# EAGLE design UIAPduino_Pro_Micro_CH32V006_V1dot0 (EAGLE 9.6.2)
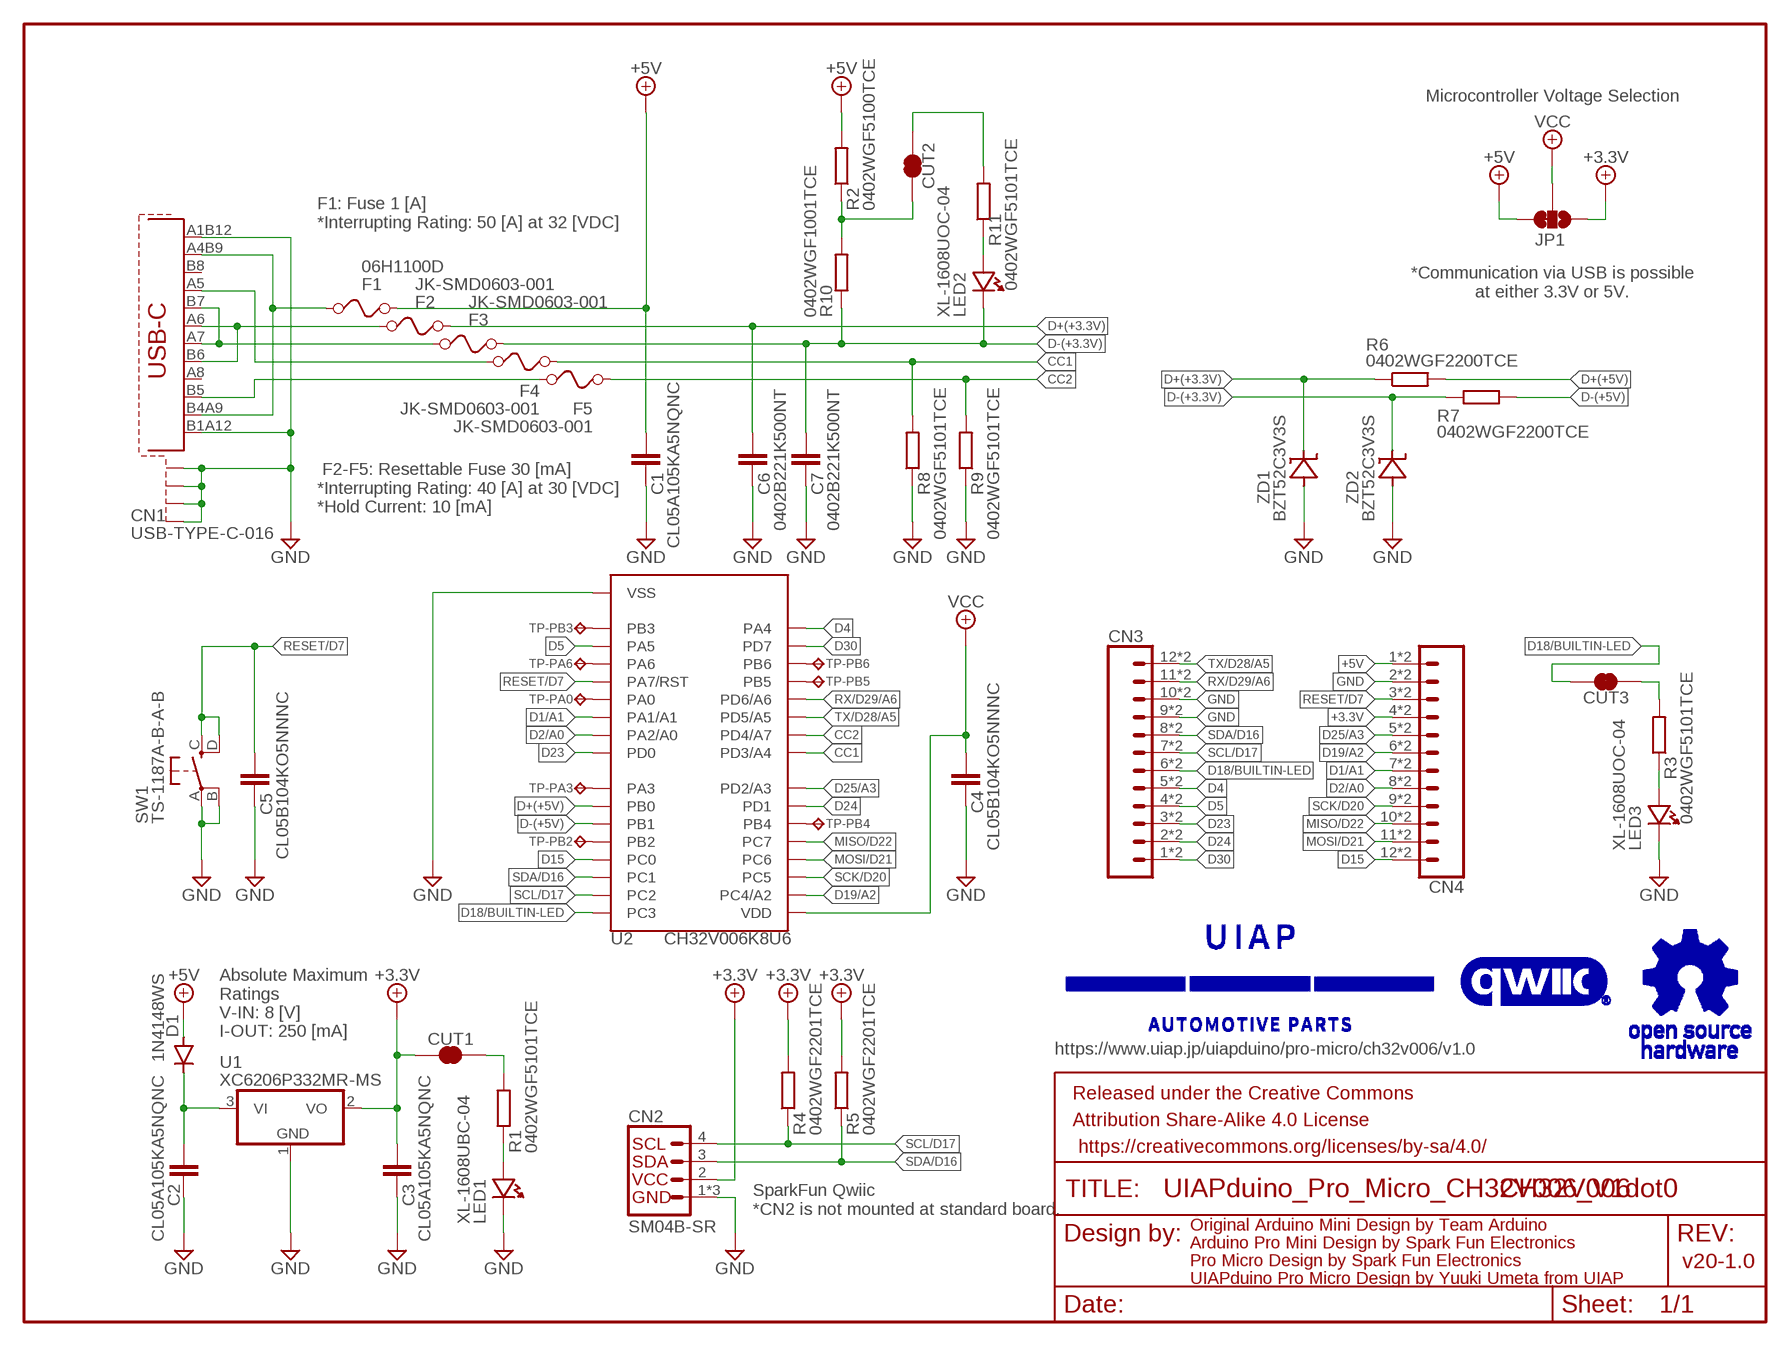
[diagram p0: schematic, sheet 1, part 1 of 2]
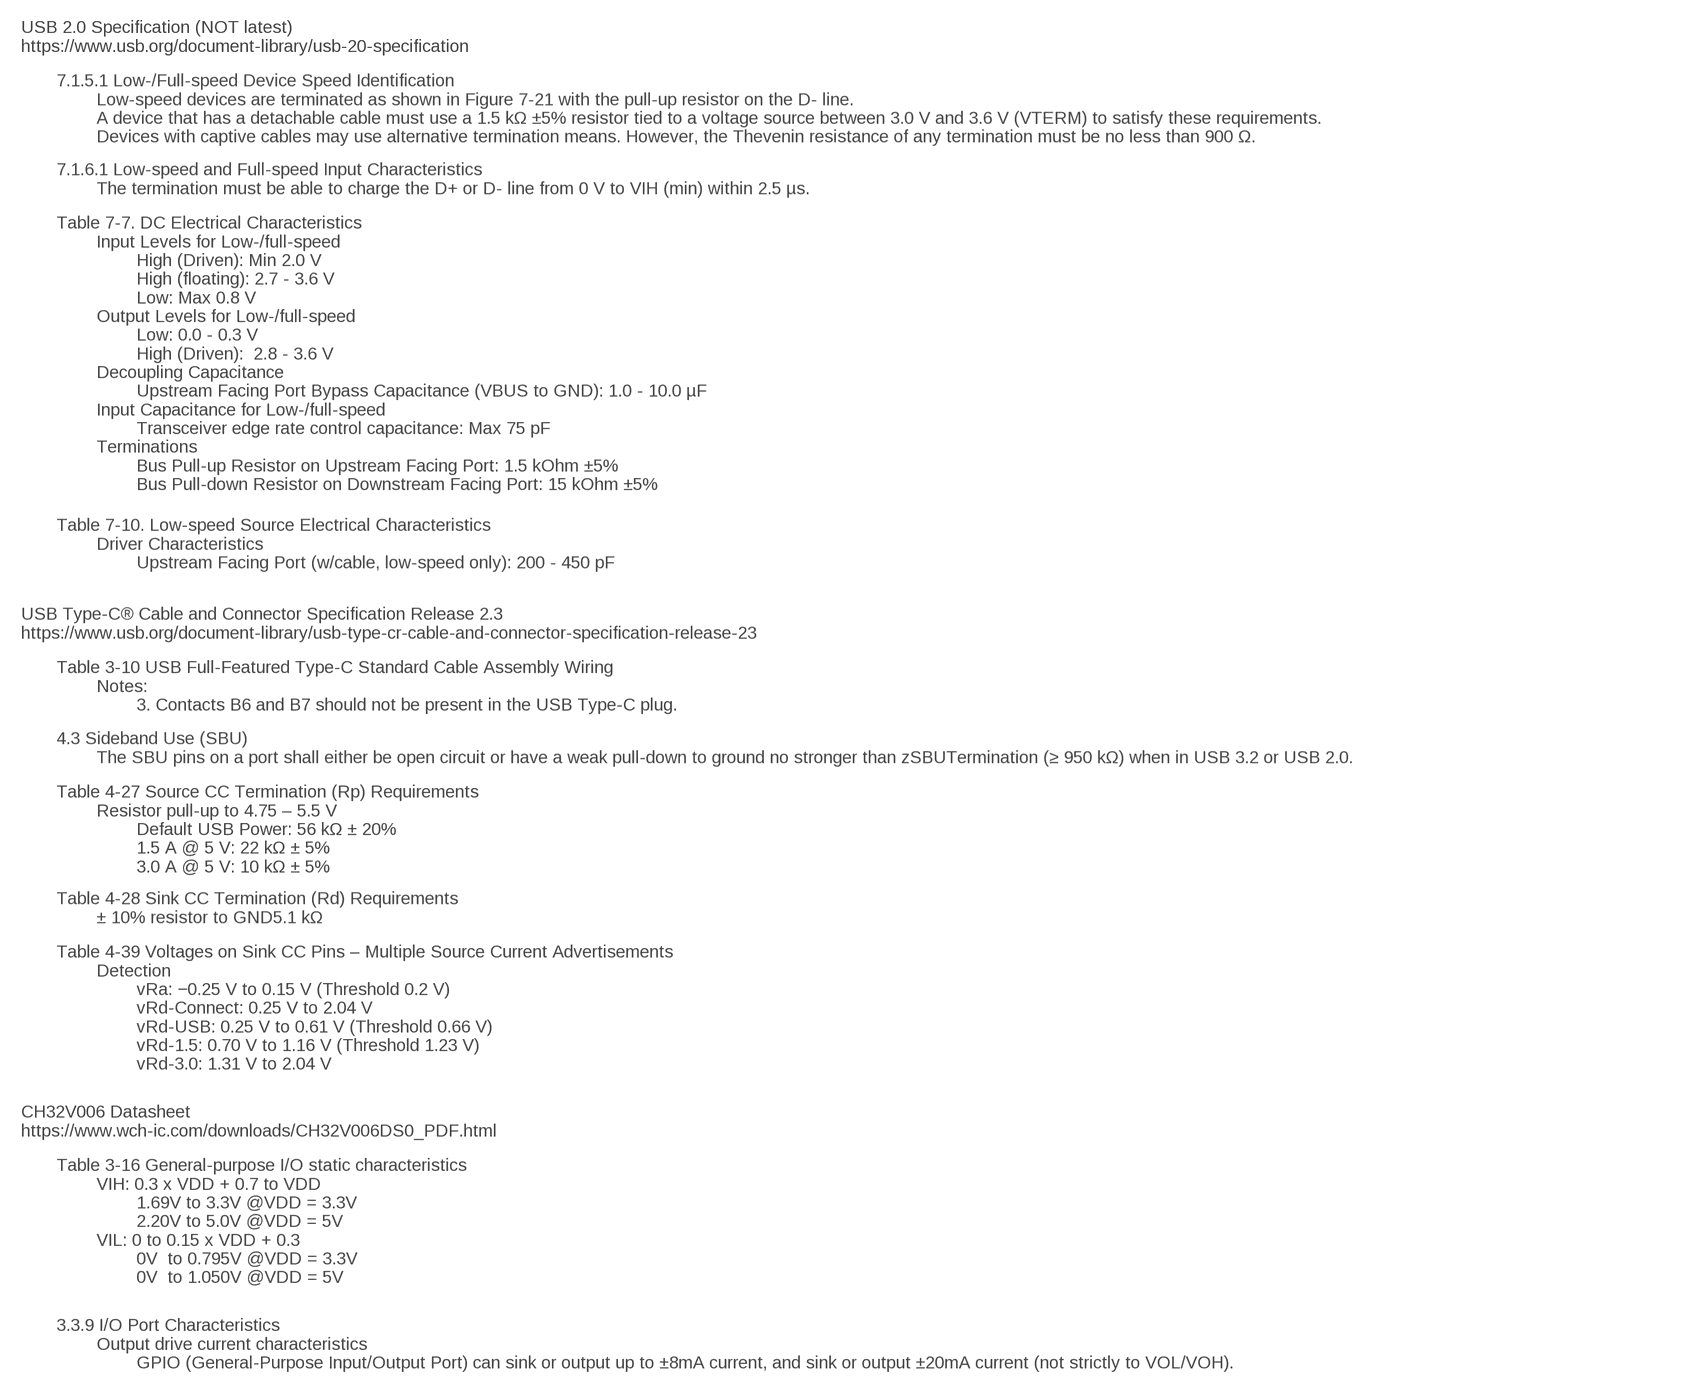
[diagram p1: schematic, sheet 1, part 2 of 2]

## Parts
C1  CL05A105KA5NQNC  C1005  [1005]
C2  CL05A105KA5NQNC  C1005  [1005]
C3  CL05A105KA5NQNC  C1005  [1005]
C4  CL05B104KO5NNNC  C1005  [1005]
C5  CL05B104KO5NNNC  C1005  [1005]
C6  0402B221K500NT  C1005  [1005]
C7  0402B221K500NT  C1005  [1005]
CN1  USB-TYPE-C-016  [USB-TYPE-C-016]
CN2  SM04B-SR  QWIIC_CONNECTORJS-1MM-GND  [JST04_1MM_RA]
CN3  CONN_12CASTLE_0.9MM  [1X12_CASTELLATED_0.9MM]
CN4  CONN_12CASTLE_0.9MM  [1X12_CASTELLATED_0.9MM]
CUT1  SMT-JP-2-NC  [SMT-JUMPER_2_NC_SILK_ROUND]
CUT2  SMT-JP-2-NC  [SMT-JUMPER_2_NC_SILK_ROUND]
CUT3  SMT-JP-2-NC  [SMT-JUMPER_2_NC_SILK_ROUND]
D1  1N4148WS  DIODE-SOD323-R  [SOD323-R]
F1  06H1100D  [1608]
F2  JK-SMD0603-001  06H1100D  [1608]
F3  JK-SMD0603-001  06H1100D  [1608]
F4  JK-SMD0603-001  06H1100D  [1608]
F5  JK-SMD0603-001  06H1100D  [1608]
FRAME1  FRAME-LETTER  [CREATIVE_COMMONS]
JP1  SMT-JP-3-NO-NC  [SMT-JUMPER_3_1-NC_TRACE_SILK]
LED1  XL-1608UBC-04  [1608-LED]
LED2  XL-1608UOC-04  [1608-LED]
LED3  XL-1608UOC-04  [1608-LED]
R1  0402WGF5101TCE  R1005  [1005]
R2  0402WGF5100TCE  R1005  [1005]
R3  0402WGF5101TCE  R1005  [1005]
R4  0402WGF2201TCE  R1005  [1005]
R5  0402WGF2201TCE  R1005  [1005]
R6  0402WGF2200TCE  R1005  [1005]
R7  0402WGF2200TCE  R1005  [1005]
R8  0402WGF5101TCE  R1005  [1005]
R9  0402WGF5101TCE  R1005  [1005]
R10  0402WGF1001TCE  R1005  [1005]
R11  0402WGF5101TCE  R1005  [1005]
SW1  TS-1187A-B-A-B  [TS-1187A-B-A-B]
TP-PA0  TPTP06R  [TP06R]
TP-PA3  TPTP06R  [TP06R]
TP-PA6  TPTP06R  [TP06R]
TP-PB2  TPTP06R  [TP06R]
TP-PB3  TPTP06R  [TP06R]
TP-PB4  TPTP06R  [TP06R]
TP-PB5  TPTP06R  [TP06R]
TP-PB6  TPTP06R  [TP06R]
U1  XC6206P332MR-MS  [SOT-23F_TOS]
U2  CH32V006K8U6  [QFN40P400X400X100-33T270]
ZD1  BZT52C3V3S  [SOD323-R]
ZD2  BZT52C3V3S  [SOD323-R]

## Nets
+3.3V [vcc]: C3.1 CN2.2 CN4.4 CN4.4B CUT1.2 JP1.1 R4.2 R5.2 U1.2(VO)
+5V [vcc]: C1.1 CN4.1 CN4.1B D1.A F1.2 JP1.3 R2.2
CC1: F4.2 R8.2 U2.25(PD3/A4)
CC2: F5.2 R9.2 U2.26(PD4/A7)
D1/A1: CN4.7 CN4.7B U2.6(PA1/A1)
D2/A0: CN4.8 CN4.8B U2.7(PA2/A0)
D4: CN3.5 CN3.5B U2.32(PA4)
D5: CN3.4 CN3.4B U2.2(PA5)
D15: CN4.12 CN4.12B U2.13(PC0)
D18/BUILTIN-LED: CN3.6 CN3.6B CUT3.1 U2.16(PC3)
D19/A2: CN4.6 CN4.6B U2.18(PC4/A2)
D23: CN3.3 CN3.3B U2.8(PD0)
D24: CN3.2 CN3.2B U2.23(PD1)
D25/A3: CN4.5 CN4.5B U2.24(PD2/A3)
D30: CN3.1 CN3.1B U2.31(PD7)
D+(+3.3V): C6.1 F2.2 R6.1 ZD1.C
D+(+5V): R6.2 U2.10(PB0)
D-(+3.3V): C7.1 F3.2 LED2.2(C) R7.1 R10.1 ZD2.C
D-(+5V): R7.2 U2.11(PB1)
F1 [vcc]: CN1.A4B9(VBUS) CN1.B4A9(VBUS) F1.1
GND [GND]: C1.2 C2.2 C3.2 C4.2 C5.2 C6.2 C7.2 CN1.A1B12(GND) CN1.B1A12(GND) CN1.S1 CN1.S1B(S1) CN1.S2 CN1.S2B(S2) CN1.S3 CN1.S3B(S3) CN1.S4 CN1.S4B(S4) CN2.1 CN2.NC1 CN2.NC2 CN3.9 CN3.9B CN3.10 CN3.10B CN4.2 CN4.2B LED1.2(C) LED3.2(C) R8.1 R9.1 SW1.A(P) SW1.B(P1) U1.1(GND) U2.0(VSS) U2.P-VIA$1(VSS) U2.P-VIA$2(VSS) U2.P-VIA$3(VSS) U2.P-VIA$4(VSS) U2.P-VIA$5(VSS) U2.P-VIA$6(VSS) U2.P-VIA$7(VSS) U2.P-VIA$8(VSS) U2.P-VIA$9(VSS) ZD1.A ZD2.A
MISO/D22: CN4.10 CN4.10B U2.21(PC7)
MOSI/D21: CN4.11 CN4.11B U2.20(PC6)
N$1: CN1.A6(DP1) CN1.B6(DP2) F2.1
N$2: CUT2.2 R2.1 R10.2
N$3: C2.1 D1.C U1.3(VI)
N$4: CN1.A7(DN1) CN1.B7(DN2) F3.1
N$5: CN1.A5(CC1) F4.1
N$6 [vcc]: CUT1.1 R1.2
N$7: LED3.1(A) R3.1
N$8: CN1.B5(CC2) F5.1
N$9: LED2.1(A) R11.1
N$10: CUT3.2 R3.2
N$11: CUT2.1 R11.2
N$12: TP-PB3.TP U2.1(PB3)
N$13: TP-PA6.TP U2.3(PA6)
N$14: TP-PA0.TP U2.5(PA0)
N$15: TP-PA3.TP U2.9(PA3)
N$16: TP-PB2.TP U2.12(PB2)
N$17: TP-PB4.TP U2.22(PB4)
N$18: TP-PB5.TP U2.29(PB5)
N$19: TP-PB6.TP U2.30(PB6)
N$38: LED1.1(A) R1.1
RESET/D7: C5.1 CN4.3 CN4.3B SW1.C(S) SW1.D(S1) U2.4(PA7/RST)
RX/D29/A6: CN3.11 CN3.11B U2.28(PD6/A6)
SCK/D20: CN4.9 CN4.9B U2.19(PC5)
SCL/D17: CN2.4 CN3.7 CN3.7B R4.1 U2.15(PC2)
SDA/D16: CN2.3 CN3.8 CN3.8B R5.1 U2.14(PC1)
TX/D28/A5: CN3.12 CN3.12B U2.27(PD5/A5)
VCC [vcc]: C4.1 JP1.2 U2.17(VDD)
Unconnected: CN1.A8(SBU1) CN1.B8(SBU2)

## Notes on the sheet
- USB 2.0 Specification (NOT latest)
  https://www.usb.org/document-library/usb-20-specification
- 7.1.5.1 Low-/Full-speed Device Speed Identification
          Low-speed devices are terminated as shown in Figure 7-21 with the pull-up resistor on the D- line.
          A device that has a detachable cable must use a 1.5 kΩ ±5% resistor tied to a voltage source between 3.0 V and 3.6 V (VTERM) to satisfy these requirements.
          Devices with captive cables may use alternative termination means. However, the Thevenin resistance of any termination must be no less than 900 Ω.
- Microcontroller Voltage Selection
- 7.1.6.1 Low-speed and Full-speed Input Characteristics
          The termination must be able to charge the D+ or D- line from 0 V to VIH (min) within 2.5 µs.
- Table 7-7. DC Electrical Characteristics
          Input Levels for Low-/full-speed
                  High (Driven): Min 2.0 V
                  High (floating): 2.7 - 3.6 V
                  Low: Max 0.8 V
          Output Levels for Low-/full-speed
                  Low: 0.0 - 0.3 V
                  High (Driven):  2.8 - 3.6 V
          Decoupling Capacitance
                  Upstream Facing Port Bypass Capacitance (VBUS to GND): 1.0 - 10.0 µF
          Input Capacitance for Low-/full-speed
                  Transceiver edge rate control capacitance: Max 75 pF
          Terminations
                  Bus Pull-up Resistor on Upstream Facing Port: 1.5 kOhm ±5%
                  Bus Pull-down Resistor on Downstream Facing Port: 15 kOhm ±5%
- F1: Fuse 1 [A]
  *Interrupting Rating: 50 [A] at 32 [VDC]
- *Communication via USB is possible
  at either 3.3V or 5V.
- F2-F5: Resettable Fuse 30 [mA]
  *Interrupting Rating: 40 [A] at 30 [VDC]
  *Hold Current: 10 [mA]
- Table 7-10. Low-speed Source Electrical Characteristics
          Driver Characteristics
                  Upstream Facing Port (w/cable, low-speed only): 200 - 450 pF
- USB Type-C® Cable and Connector Specification Release 2.3
  https://www.usb.org/document-library/usb-type-cr-cable-and-connector-specification-release-23
- Table 3-10 USB Full-Featured Type-C Standard Cable Assembly Wiring
          Notes:
                  3. Contacts B6 and B7 should not be present in the USB Type-C plug.
- 4.3 Sideband Use (SBU)
          The SBU pins on a port shall either be open circuit or have a weak pull-down to ground no stronger than zSBUTermination (≥ 950 kΩ) when in USB 3.2 or USB 2.0.
- Table 4-27 Source CC Termination (Rp) Requirements
          Resistor pull-up to 4.75 – 5.5 V
                  Default USB Power: 56 kΩ ± 20%
                  1.5 A @ 5 V: 22 kΩ ± 5%
                  3.0 A @ 5 V: 10 kΩ ± 5%
- Table 4-28 Sink CC Termination (Rd) Requirements
          ± 10% resistor to GND5.1 kΩ
- Table 4-39 Voltages on Sink CC Pins – Multiple Source Current Advertisements
          Detection
                  vRa: −0.25 V to 0.15 V (Threshold 0.2 V)
                  vRd-Connect: 0.25 V to 2.04 V
                  vRd-USB: 0.25 V to 0.61 V (Threshold 0.66 V)
                  vRd-1.5: 0.70 V to 1.16 V (Threshold 1.23 V)
                  vRd-3.0: 1.31 V to 2.04 V
- Absolute Maximum
  Ratings
  V-IN: 8 [V]
  I-OUT: 250 [mA]
- https://www.uiap.jp/uiapduino/pro-micro/ch32v006/v1.0
- CH32V006 Datasheet
  https://www.wch-ic.com/downloads/CH32V006DS0_PDF.html
- Table 3-16 General-purpose I/O static characteristics
          VIH: 0.3 x VDD + 0.7 to VDD
                  1.69V to 3.3V @VDD = 3.3V
                  2.20V to 5.0V @VDD = 5V
          VIL: 0 to 0.15 x VDD + 0.3
                  0V  to 0.795V @VDD = 3.3V
                  0V  to 1.050V @VDD = 5V
- CH32V006
- SparkFun Qwiic
  *CN2 is not mounted at standard board.
- Original Arduino Mini Design by Team Arduino
- Arduino Pro Mini Design by Spark Fun Electronics
- Pro Micro Design by Spark Fun Electronics
- UIAPduino Pro Micro Design by Yuuki Umeta from UIAP | v20-1.0
- 3.3.9 I/O Port Characteristics
          Output drive current characteristics
                  GPIO (General-Purpose Input/Output Port) can sink or output up to ±8mA current, and sink or output ±20mA current (not strictly to VOL/VOH).

## Library data of the parts
C1-C7 = Mylib_e2:C
CN1 = Mylib_e2:USB-TYPE-C; JLCPCB-PART-#: C2927036; URL: https://jlcpcb.com/partdetail/DEALON-USB_TYPE_C016/C2927036
CN2 = SparkFun-Connectors:QWIIC_CONNECTOR: SparkFun I2C Standard Qwiic Connector An SMD 1mm pitch JST connector makes it easy and quick (get it? Qwiic?) to connect I2C devices to each other. The Qwiic system <http://www.sparkfun.com/qwiic> enables fast and solderless connection between popular platforms and various sensors and actuators. We carry 200mm <https://www.sparkfun.com/products/14204>, 100mm <https://www.sparkfun.com/products/14205>, 50mm <https://www.sparkfun.com/products/14206>, and breadboard friendly <https://www.sparkfun.com/products/14207> Qwiic cables. We also offer 10 pcs strips <https://www.sparkfun.com/products/14323> the SMD connectors.; PROD_ID: CONN-13694; VALUE: QWIIC_RIGHT_ANGLE
CN3 CN4 = Castellated:CONN_12: Multi connection point. Often used as Generic Header-pin footprint for 0.1 inch spaced/style header connections On any of the 0.1 inch spaced packages, you can populate with these: Break Away Headers - Straight <https://www.sparkfun.com/products/116> (PRT-00116) Break Away Male Headers - Right Angle <https://www.sparkfun.com/products/553> (PRT-00553) Female Headers <https://www.sparkfun.com/products/115> (PRT-00115) Break Away Headers - Machine Pin <https://www.sparkfun.com/products/117> (PRT-00117) Break Away Female Headers - Swiss Machine Pin <https://www.sparkfun.com/products/743> (PRT-00743) For SCREWTERMINALS and SPRING TERMINALS visit here: Screw Terimnals on SparkFun.com <https://www.sparkfun.com/search/results?term=Screw+Terminals> (5mm/3.5mm/2.54mm spacing) This device is also useful as a general connection point to wire up your design to another part of your project. Our various solder wires solder well into these plated through hole pads. Hook-Up Wire - Assortment (Stranded, 22 AWG) <https://www.sparkfun.com/products/11375> (PRT-11375) Hook-Up Wire - Assortment (Solid Core, 22 AWG) <https://www.sparkfun.com/products/11367> (PRT-11367) View the entire wire category on our website here <https://www.sparkfun.com/categories/141> Special notes: Molex polarized connector foot print use with SKU : PRT-08231 with associated crimp pins and housings. 1MM SMD Version SKU: PRT-10208 NOTES ON THE VARIANTS LOCK and LOCK_LONGPADS... This footprint was designed to help hold the alignment of a through-hole component (i.e. 6-pin header) while soldering it into place. You may notice that each hole has been shifted either up or down by 0.005 of an inch from it's more standard position (which is a perfectly straight line). This slight alteration caused the pins (the squares in the middle) to touch the edges of the holes. Because they are alternating, it causes a "brace" to hold the component in place. 0.005 has proven to be the perfect amount of "off-center" position when using our standard breakaway headers. Although looks a little odd when you look at the bare footprint, once you have a header in there, the alteration is very hard to notice. Also,if you push a header all the way into place, it is covered up entirely on the bottom side.
CUT1-CUT3 = Mylib_e2:SMT-JP-2-NC
D1 = diode:DIODE-: DIODE; JLCPCB-PART-#: C2128; URL: https://jlcpcb.com/partdetail/2485-1N4148WS/C2128
F1-F5 = Mylib_e2:06H1100D; JLCPCB-PART-#: C182303; URL: https://jlcpcb.com/partdetail/Shenzhen_lansonElec-06H1100D/C182303
FRAME1 = SparkFun-Aesthetics:FRAME-LETTER: Schematic Frame - Letter Standard 8.5x11 US Letter frame
JP1 = Mylib_e2:SMT-JP-3-NO-NC
LED1 = Mylib_e2:XL-1608UBC-04; JLCPCB-PART-#: C965807; URL: https://jlcpcb.com/partdetail/C965807
LED2 LED3 = Mylib_e2:XL-1608UOC-04; JLCPCB-PART-#: C965801; URL: https://jlcpcb.com/partdetail/C965801
R1-R11 = Mylib_e2:R
SW1 = Mylib_e2:TS-1187A-B-A-B; JLCPCB-PART-#: C318884; URL: https://jlcpcb.com/partdetail/XKBConnection-TS_1187A_B_AB/C318884
TP-PA0 TP-PA3 TP-PA6 TP-PB2-TP-PB6 = testpad:TP: Test pad
U1 = Mylib_e2:XC6206P332MR-MS; JLCPCB-PART-#: C5252899; URL: https://jlcpcb.com/partdetail/C5252899
U2 = Mylib_e2:CH32V006K8U6
ZD1 ZD2 = Mylib_e2:BZT52C3V3S; JLCPCB-PART-#: C5190164; URL: https://jlcpcb.com/partdetail/GuangdongHottech-BZT52C3V3S/C5190164

## Net classes
0 default: width 0.203 mm
1 vcc: width 0.305 mm
2 GND: width 0.508 mm

## Board
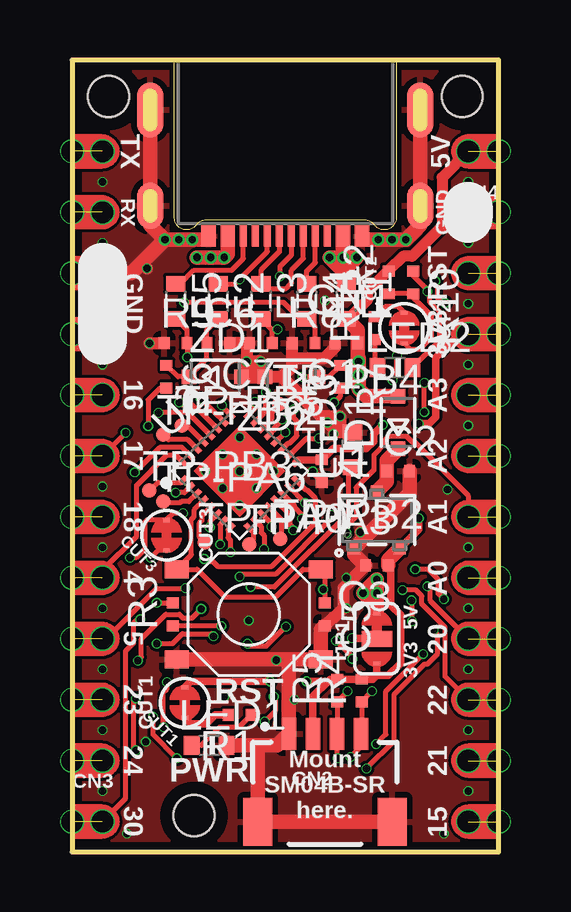
[diagram p2: board, top side]
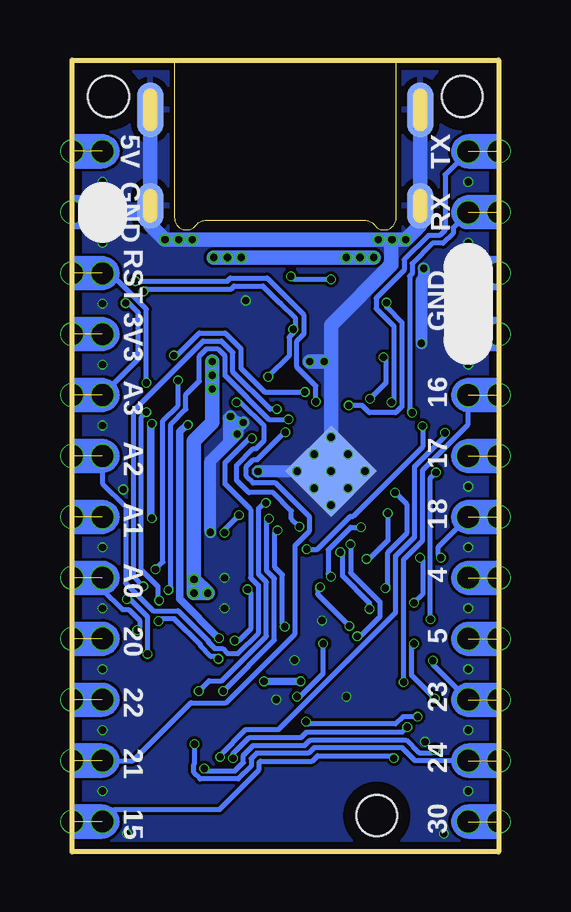
[diagram p3: board, bottom side, seen from below]

Size 17.78 x 33.02 mm. Coordinates in mm from the lower left corner, seen from the top.
Outline: 0,33.02 0,0 17.78,0 17.78,33.02 0,33.02
Copper layers (1*16): Top 0.035mm / dielectric 1.5mm / Bottom 0.035mm
Design rules "SparkFun-2-layer-FAB-LIMIT *": minimum track width 5mil, minimum drill 0.3mm, track to track 5mil, track to pad 5mil, pad to pad 5mil, via to via 5mil, smd to smd 4mil, copper to edge 0.3mm, drill to drill 0.5mil, minimum pad ring 0.05mm, minimum via ring 0.05mm, stop-mask expansion 2mil, vias tented up to drill 25mil, thermal gap 10mil
Holes 1.7 mm at 1.52,31.5 16.26,31.5 5.08,1.52
tRestrict: area 0.1,30.1 to 2.9,32.9; area 14.9,30.1 to 17.7,32.9; area 3.7,0.1 to 6.5,2.9; area -2.5,0 to 0,33; area 17.8,0 to 20.3,33
bRestrict: area 0.1,30.1 to 2.9,32.9; area 14.9,30.1 to 17.7,32.9; area 3.7,0.1 to 6.5,2.9; area -2.5,0 to 0,33; area 17.8,0 to 20.3,33

### Footprints (pad centres in the part's own frame; a part is rotated, then mirrored left to right if it is on the bottom)
1005 = smd 0.45 x 0.5: 1 -0.475,0; 2 0.475,0
USB-TYPE-C-016 = smd 0.6 x 0.9: A1B12 -3.2,2.685; A4B9 -2.4,2.685; B1A12 3.2,2.685; B4A9 2.4,2.685 | smd 0.3 x 0.9: A5 -1.25,2.685; A6 -0.25,2.685; A7 0.25,2.685; A8 1.25,2.685; B5 1.75,2.685; B6 0.75,2.685; B7 -0.75,2.685; B8 -1.75,2.685 | smd 1.1 x 1.9: S1 -5.62,1.435; S2 5.62,1.435 | smd 1.1 x 1.9 bottom: S1B -5.62,1.435; S2B 5.62,1.435 | smd 1.1 x 2.3: S3 -5.62,-2.565; S4 5.62,-2.565 | smd 1.1 x 2.3 bottom: S3B -5.62,-2.565; S4B 5.62,-2.565
JST04_1MM_RA = smd 0.6 x 1.35: 1 -1.5,0; 2 -0.5,0; 3 0.5,0; 4 1.5,0 | smd 1.2 x 2: NC1 2.8,-3.675; NC2 -2.8,-3.675
1X12_CASTELLATED_0.9MM = drill 0.9 pad 1.016: 1 0,0; 2 0,2.54; 3 0,5.08; 4 0,7.62; 5 0,10.16; 6 0,12.7; 7 0,15.24; 8 0,17.78; 9 0,20.32; 10 0,22.86; 11 0,25.4; 12 0,27.94 | drill 0.9 pad 0.95: 1B -1.27,0; 2B -1.27,2.54; 3B -1.27,5.08; 4B -1.27,7.62; 5B -1.27,10.16; 6B -1.27,12.7; 7B -1.27,15.24; 8B -1.27,17.78; 9B -1.27,20.32; 10B -1.27,22.86; 11B -1.27,25.4; 12B -1.27,27.94
SMT-JUMPER_2_NC_SILK_ROUND = smd 0.152 x 0.305: 1 -0.635,0; 2 0.635,0
SOD323-R = smd 0.6 x 0.6: A 1.1,0; C -1.1,0
1608 = smd 0.8 x 0.65: 1 0,-0.725; 2 0,0.725
SMT-JUMPER_3_1-NC_TRACE_SILK = smd 0.152 x 0.305: 1 -1.041,0; 3 1.041,0 | smd 0.66 x 1.27: 2 0,0
1608-LED = smd 0.8 x 0.65: 1 0,-0.725; 2 0,0.725
TS-1187A-B-A-B = smd 1 x 0.75: A -3,1.875; B 3,1.875; C -3,-1.875; D 3,-1.875
TP06R = smd 0.6 x 0.6: TP 0,0
SOT-23F_TOS = smd 0.508 x 0.508: 1 -0.95,-1.194; 2 0.95,-1.194; 3 0,1.194
QFN40P400X400X100-33T270 = smd 2.7 x 2.7 bottom: 0 0,0 | smd 0.375 x 0.22: 1 -1.913,1.4; 2 -1.913,1; 3 -1.913,0.6; 4 -1.913,0.2; 5 -1.913,-0.2; 6 -1.913,-0.6; 7 -1.913,-1; 8 -1.913,-1.4; 17 1.913,-1.4; 18 1.913,-1; 19 1.913,-0.6; 20 1.913,-0.2; 21 1.913,0.2; 22 1.913,0.6; 23 1.913,1; 24 1.913,1.4 | smd 0.22 x 0.375: 9 -1.4,-1.913; 10 -1,-1.913; 11 -0.6,-1.913; 12 -0.2,-1.913; 13 0.2,-1.913; 14 0.6,-1.913; 15 1,-1.913; 16 1.4,-1.913; 25 1.4,1.913; 26 1,1.913; 27 0.6,1.913; 28 0.2,1.913; 29 -0.2,1.913; 30 -0.6,1.913; 31 -1,1.913; 32 -1.4,1.913 | drill 0.3 pad 0.35: P-VIA$1 -1,1; P-VIA$2 0,1; P-VIA$3 1,1; P-VIA$4 -1,0; P-VIA$5 0,0; P-VIA$6 1,0; P-VIA$7 -1,-1; P-VIA$8 0,-1; P-VIA$9 1,-1

### Placement (x,y rotation side)
C1  11.43,21.21 180 top
C2  13.59,15.88 0 top
C3  12.7,11.94 180 top
C4  10.41,15.88 270 top
C5  10.54,9.91 270 top
C6  6.1,21.21 0 top
C7  7.87,21.21 180 top
CN1  8.89,28.37 180 top
CN2  10.54,4.93 0 top
CN3  1.27,1.27 0 top
CN4  16.51,29.21 180 top
CUT1  4.7,6.22 90 top
CUT2  13.84,21.84 270 top
CUT3  3.94,13.21 270 top
D1  13.59,17.91 90 top
F1  11.43,22.96 180 top
F2  6.1,22.96 180 top
F3  7.87,22.96 180 top
F4  9.78,22.96 180 top
F5  4.32,22.96 180 top
FRAME1  -20.32,-12.7 0 top  (outside the outline)
JP1  12.7,8.89 90 top
LED1  5.71,4.45 270 top
LED2  13.46,20.19 270 top
LED3  11.68,16.76 0 top
R1  6.99,5.71 180 top
R2  13.21,23.75 90 top
R3  4.19,9.91 90 top
R4  12.06,6.73 90 top
R5  11.05,6.73 90 top
R6  3.94,19.81 270 top
R7  11.18,19.81 270 top
R8  9.65,21.21 0 top
R9  4.32,21.21 0 top
R10  14.22,23.75 270 top
R11  12.62,21.84 90 top
SW1  7.37,9.91 180 top
TP-PA0  5.54,12.9 0 top
TP-PA3  7.39,12.83 0 top
TP-PA6  3.81,14.61 0 top
TP-PB2  8.69,13.06 0 top
TP-PB3  3.23,15.06 0 top
TP-PB4  8.64,18.67 0 top
TP-PB5  4.57,17.78 0 top
TP-PB6  3.81,17.4 0 top
U1  12.7,13.84 0 top
U2  6.99,15.88 45 top
ZD1  5.97,19.81 0 top
ZD2  9.14,19.81 180 top

### Tracks (layer width: path | path; a pad name or v marks a point on that pad's centre or on a via)
+3.3V  (via drill 0.3)  (1 unrouted)
  Top 0.305: CN2.2 10.04,6.49 10.67,7.11 | 10.67,7.11 10.76,7.21 R5.2 R4.2 12.54,7.21 12.7,7.37 | JP1.1 12.7,7.37 | CUT1.2 4.95,7.11 v8.26,7.11 | v9.78,7.11 10.67,7.11 | C3.1 13.28,11.83 13.28,10.29 13.69,9.88 13.69,7.87 13.18,7.37 12.7,7.37 | CN4.4 16.13,21.59 15.16,20.62 15.16,18.14 14.88,17.86 v14.46,17.86 v14.45,17.86 | v14.45,13.92 14.45,13.45 U1.2
  Top 0.61: U1.2 13.18,12.17 C3.1
  Bottom 0.305: v8.26,7.11 v9.78,7.11 | v14.45,17.86 14.5,17.8 14.5,13.97 v14.45,13.92
+5V  (via drill 0.3 pad 0.5)  (1 unrouted)
  Top 0.305: R2.2 13.21,24.26
  Top 0.457: CN4.1 15.42,28.12 15.42,26.09 14.17,24.84 13.79,24.84 13.21,24.26 12.32,23.37 12.32,23.02 11.53,22.24 F1.2
  Top 0.61: 11.94,19.94 v11.94,20.45 v11.94,19.88 v11.94,19.3 | v12.7,11.37 v12.7,11.36 | v12.7,11.36 v12.7,10.79 | v11.94,19.3 11.94,20.57 11.9,20.61 C1.1 11.9,21.76 F1.2 | v12.7,10.79 JP1.3 12.7,10.22 v12.13,10.79 | v12.13,10.79 12.62,11.28 v12.7,11.36 | v12.13,10.79 v12.7,10.79 | D1.A 12.23,19.01 v11.94,19.3
  Bottom 0.61: v12.7,11.37 12.7,17.14 11.94,17.91 v11.94,19.3 v11.94,19.88 v11.94,20.45 | v12.7,11.37 v12.7,10.79 v12.13,10.79 v12.7,11.37
CC1  (via drill 0.3)
  Top 0.203: R8.2 10.13,21.89 F4.2 9.49,22.24 8.81,22.91 v4.67,22.91 | U2.25 6.25,18.59 v6.25,18.62
  Bottom 0.203: v6.25,18.62 5.69,18.62 5.38,18.31 4.29,18.31 4.04,18.57 4.04,22.07 4.67,22.71 v4.67,22.91
CC2  (via drill 0.3)
  Top 0.203: F5.2 4.79,21.76 R9.2 v4.8,20.62 | U2.26 6.08,18.19 6.07,18.19 v5.36,18.9
  Bottom 0.203: v5.36,18.9 4.7,19.56 4.7,20.52 v4.8,20.62
D1/A1  (via drill 0.3)  (1 unrouted)
  Top 0.203: CN4.7 16.51,14.86 14.28,17.09 14.18,17.09 13.93,17.34 13.2,17.34 13.06,17.2 13.06,17.05 12.57,16.56 12.57,15.93 11.84,15.19 11.84,13.97 11.43,13.56 v11.43,13.31 | v6.99,11.48 7.09,11.58 8.48,11.58 10.82,13.92 v10.82,14.05 | U2.6 5.74,13.78 v5.74,13.54
  Bottom 0.203: v5.74,13.54 6.17,13.54 7.11,12.6 7.11,11.61 v6.99,11.48 | v11.43,13.31 11.43,13.44 v10.82,14.05
D2/A0  (via drill 0.3)  (1 unrouted)
  Top 0.203: v5.89,8.99 5.79,9.09 4.6,9.09 4.19,8.69 v3.53,8.69 | v2.67,6.4 2.56,6.3 2.56,4.34 v2.67,4.24 | v12.27,3.48 13.41,4.62 13.41,6.55 14.68,7.82 14.81,7.82 15.21,8.23 15.21,9.09 v15.06,9.25 | U2.7 6.17,13.65 v6.17,12.83
  Bottom 0.203: v5.89,8.99 5.77,8.99 4.95,9.8 4.96,9.81 4.96,10.43 6.17,11.64 v6.17,12.83 | v3.53,8.69 3.63,8.59 3.63,7.37 v2.67,6.4 | v2.67,4.24 2.77,4.14 3.33,4.14 3.86,4.67 7.85,4.67 8.08,4.45 10.24,4.45 10.64,4.04 10.64,3.73 11,3.38 12.17,3.38 v12.27,3.48 | v15.06,9.25 14.96,9.35 14.96,9.65 15.42,10.11 15.67,10.11 16.51,10.95 CN4.8
D4  (1 unrouted)
  Top 0.203: CN3.5 1.27,11.73 2.69,13.16 2.69,15.29 3.94,16.54 4.34,16.54 U2.32
D5  (via drill 0.3)  (1 unrouted)
  Top 0.203: v4.72,11 3.53,11 1.42,8.89 CN3.4 | U2.2 4.68,14.99 v4.32,14.99
  Bottom 0.203: v4.72,11 4.62,11.1 4.62,12.5 3.83,13.28 3.83,14.5 v4.32,14.99
D15  (via drill 0.3)  (1 unrouted)
  Top 0.203: v8.91,9.4 8.1,8.59 7.42,8.59 v7.32,8.69 | v8.41,6.48 8.48,6.4 8.48,5.89 v8.03,5.44 | v3.38,5.64 3.38,4.9 v4.37,3.91 | U2.13 9.07,14.07 9.07,13.66 9.22,13.52 v9.22,13.41
  Bottom 0.203: v8.91,9.4 9.02,9.5 9.02,11.56 9.35,11.89 9.35,13.28 v9.22,13.41 | v7.32,8.69 7.32,7.44 8.28,6.48 v8.41,6.48 | v8.03,5.44 7.92,5.33 4.29,5.33 3.99,5.64 v3.38,5.64 | v4.37,3.91 4.47,4.01 7.54,4.01 7.77,3.79 9.93,3.79 9.98,3.73 9.98,3.43 11.63,1.78 16,1.78 CN4.12
D18/BUILTIN-LED  (via drill 0.3)  (1 unrouted)
  Top 0.203: v2.41,12.27 2.67,12.27 3.02,12.62 3.02,13.74 3.12,13.84 CUT3.1 4.22,14.12 v4.62,14.12 | v5.51,12.22 5.61,12.12 5.87,12.12 6.07,11.91 8.33,11.91 10.13,13.72 10.13,14.76 9.78,15.11 9.73,15.11 U2.16
  Bottom 0.203: CN3.6 2.52,12.72 2.52,12.37 v2.41,12.27 | v5.51,12.22 5.38,12.22 4.62,12.98 v4.62,14.12
D19/A2  (via drill 0.3)  (1 unrouted)
  Top 0.203: U2.18 9.77,17.25 v10.29,17.25
  Bottom 0.203: v10.29,17.25 10.39,17.25 11.4,16.23 11.4,15.34 10.34,14.28 10.34,11.43 10.01,11.1 10.01,9.14 10.87,8.28 11.3,8.28 11.51,8.48 11.84,8.48 12.09,8.74 12.09,8.79 13.36,10.06 14.4,10.06 15.54,11.2 15.54,14.4 16.51,15.37 CN4.6
D23  (via drill 0.3)  (1 unrouted)
  Top 0.203: v5.38,10.13 5,9.75 4.62,9.75 4.47,9.91 3.91,9.91 2.9,8.89 2.9,8.13 v2.74,7.98 | U2.8 6.5,13.41 6.5,13.1 6.6,13.01 v6.6,12.5
  Bottom 0.203: v6.6,12.5 6.5,12.39 6.5,11.51 5.38,10.39 v5.38,10.13 | v2.74,7.98 2.74,7.82 CN3.3
D24  (via drill 0.3)  (1 unrouted)
  Top 0.203: v13.54,20.7 13.54,19.84 v13.36,19.66 | v14.3,11.79 14.83,11.79 15.24,11.38 15.24,10.79 v15.49,10.54 | v14.63,8.26 13.08,6.71 13.08,4.9 v12.68,4.5 | U2.23 8,18.31 8,18.48 8.08,18.55 v8.08,19.18
  Bottom 0.203: v8.08,19.18 9.75,19.18 10.74,20.17 10.74,20.98 11.4,21.64 12.47,21.64 13.41,20.7 v13.54,20.7 | v13.36,19.66 13.36,18.62 13.99,17.98 13.99,12.09 v14.3,11.79 | v15.49,10.54 15.37,10.54 14.63,9.8 v14.63,8.26 | v12.68,4.5 12.68,3.68 12.7,3.66 12.7,3.3 12.45,3.05 10.85,3.05 10.31,3.58 10.31,3.89 10.08,4.12 7.92,4.12 7.7,4.34 4.01,4.34 3.48,3.81 CN3.2
D25/A3  (via drill 0.3)  (1 unrouted)
  Top 0.203: v15.14,23.8 15.14,23.65 15.24,23.55 15.24,23.06 15.42,22.89 v15.54,22.89 | U2.24 7.62,18.49 v7.62,18.77
  Bottom 0.203: v15.14,23.8 11.3,23.8 11.18,23.93 9.65,23.93 8.13,22.4 8.13,21.59 8.41,21.31 8.41,20.22 7.62,19.43 v7.62,18.77 | v15.54,22.89 15.42,22.89 15.01,22.48 15.01,20.55 CN4.5
D30  (via drill 0.3)  (1 unrouted)
  Top 0.203: v2.62,15.82 3.66,16.87 4.58,16.87 U2.31 | v2.85,9.7 2.72,9.7 2.56,9.55 2.56,8.71 2.23,8.38 2.23,2.23 CN3.1
  Bottom 0.203: v2.62,15.82 2.85,15.6 v2.85,9.7
D+(+3.3V)
  Top 0.203: R6.1 4.41,19.81 ZD1.C 5.62,20.56 C6.1 5.62,21.76 F2.2
D+(+5V)  (via drill 0.3)
  Top 0.203: v3.17,17.75 3.17,18.85 3.66,19.33 R6.2 | U2.10 7.88,13.57 7.88,13.32 8,13.2 v8,12.62
  Bottom 0.203: v3.17,17.75 3.17,16.89 6.07,13.99 6.18,13.99 7.55,12.62 v8,12.62
D-(+3.3V)  (via drill 0.3)
  Top 0.203: C7.1 8.35,21.76 | 8.35,21.76 F3.2 | R7.1 10.7,19.81 ZD2.C v9.6,19.81 | R10.1 14.22,24.03 14.85,23.41 | 14.85,23.41 14.91,23.34 14.91,22.91 15.32,22.5 15.32,21.32 LED2.2 | v14.81,23.37 14.85,23.41 | v8.56,21.79 8.38,21.79 8.35,21.76
  Bottom 0.203: v9.6,19.81 8.74,20.68 8.74,21.46 8.56,21.64 v8.56,21.79 8.56,21.82 8.46,21.92 8.46,22.25 9.09,22.89 9.12,22.89 9.83,23.6 11.02,23.6 11.15,23.47 14.71,23.47 v14.81,23.37
D-(+5V)  (via drill 0.3)
  Top 0.203: U2.11 8.31,13.71 v8.31,13.56 | R7.2 11.18,19 v10.92,18.74
  Bottom 0.203: v10.92,18.74 10.75,18.74 9.78,17.77 9.78,17.15 10.11,16.82 10.23,16.82 10.92,16.12 10.92,15.49 10.41,14.99 9.4,14.99 8.64,14.22 8.64,13.89 v8.31,13.56
F1  (via drill 0.3 pad 0.5)
  Top 0.61: v5.21,24.79 v5.78,24.79 v6.35,24.79 6.49,24.93 CN1.B4A9 | v11.3,24.79 v10.73,24.79 11.43,24.09 F1.1 | v11.3,24.79 v11.87,24.79 11.43,24.35 F1.1 | CN1.A4B9 11.29,24.8 v11.3,24.79 | v11.3,24.79 11.43,24.66 F1.1
  Bottom 0.61: v5.21,24.79 v5.78,24.79 v6.35,24.79 v10.73,24.79 v11.3,24.79 v11.87,24.79
GND  (via drill 0.3, 0.3 pad 0.5)
  Top 0.305: v10.03,15.86 10.41,15.48 C4.2
  Top 0.508: 9.17,20.6 9.17,20.24 8.74,19.81 | 9.17,20.6 R8.1 | ZD2.A 8.74,19.81 | C3.2 11.3,11.02 11.3,10.16 10.92,9.78 10.88,9.78 C5.2 | C1.2 10.96,21.04 10.49,20.57 9.2,20.57 9.17,20.6 | v7.27,20.45 7.27,21.08 C7.2 C6.2 | v7.27,20.45 7.27,19.84 | v7.87,20.45 v7.27,20.45 | v7.87,20.45 7.27,19.84 | 7.27,19.84 7.27,19.81 | v7.87,20.45 7.87,20.07 7.62,19.81 | v3.23,21.21 R9.1 | v3.12,24.33 3.1,24.33 2.89,24.54 | v12.01,13.34 12.22,13.12 | LED3.2 11.43,17.49 | 11.43,17.49 11.06,17.49 | 11.06,17.49 v10.64,17.91 | v10.64,17.91 10.39,18.16 | 10.39,18.16 8.74,19.81 | v10.64,17.91 10.9,17.65 v10.9,17.42 10.96,17.49 11.06,17.49 | v10.64,17.91 10.92,17.91 v11.18,18.16 | v11.18,18.16 11.18,17.74 11.43,17.49 | v11.18,18.16 10.39,18.16
  Top 0.61: CN1.S4B CN1.S2B 3.27,26.13 v3.87,25.53 | CN1.S3 CN1.S1 14.51,26.13 v13.91,25.53 v13.34,25.53 v12.76,25.53 12.25,25.53 CN1.A1B12 | v3.87,25.53 v4.45,25.53 v5.02,25.53 5.53,25.53 CN1.B1A12 | C3.2 11.75,12.41 U1.1 12.22,13.12 14.06,14.96 C2.2 | CN2.NC1 CN2.NC2 7.74,4.44 7.75,4.45 | CN3.9 v1.27,22.86 CN3.10 2.48,24.13 2.89,24.54 v3.87,25.53 | SW1.B 9.02,8.03 | 9.02,8.03 SW1.A 10.37,9.26 C5.2 | LED1.2 7.75,4.45 | 7.75,4.45 8.56,4.45 CN2.1 9.04,8.01 9.02,8.03 | ZD1.A 7.27,19.81 7.62,19.81 ZD2.A
  Bottom 0.508: v3.23,21.21 3.23,23.8 3.12,23.9 v3.12,24.33 | v12.01,13.34 12.01,16.31 11.25,17.07 | 11.25,17.07 v10.9,17.42 | v10.9,17.42 10.9,17.65 v10.64,17.91 10.92,17.91 v11.18,18.16 | v10.9,17.42 11.18,17.7 v11.18,18.16 | v11.18,18.16 11.25,18.09 11.25,17.07 | v10.03,15.86 10.02,15.88 U2.P-VIA$5
  Bottom 0.61: CN1.S4B CN1.S2B 3.27,26.13 v3.87,25.53 v4.45,25.53 | CN1.S3 CN1.S1 | CN4.2 14.78,26.67 CN1.S1 | v4.45,25.53 v5.02,25.53 v12.76,25.53 v13.34,25.53 v13.91,25.53 14.51,26.13 CN1.S1 | CN3.10 v1.27,22.86 CN3.9 | v4.45,25.53 4.47,25.5 4.47,24.48 6.99,21.97 6.99,20.45 | 6.99,20.45 U2.P-VIA$3 | 6.99,20.45 v7.27,20.45 v7.87,20.45
  other vias: 1.27,27.94 1.27,25.4 1.27,20.32 1.27,15.24 1.27,12.7 1.27,10.16 1.27,7.62 1.27,5.08 1.27,2.54 16.51,2.54 16.51,5.08 16.51,7.62 16.51,10.16 16.51,12.7 15.65,15.11 16.51,17.78 16.51,20.32 16.51,22.86 16.51,25.4 16.51,27.94 11.43,10.16 11.43,11.43 2.29,0.76 15.49,0.76 7.37,9.65 8.51,8 9.27,6.35 6.35,6.48 3.07,4.6 10.54,22.99
  cutout Top: 4.95,16 6.86,17.91 arc-90 7.11,17.91 9.02,16 arc-90 9.02,15.75 7.11,13.84 arc-90 6.86,13.84 4.95,15.75 arc-90
  cutout Top: 11.86,8.34 11.86,9.44 arc-90 12.7,10.28 arc-90 13.54,9.44 13.54,8.34 arc-90 12.7,7.5 arc-90
  cutout Top: 4.19,33.02 13.59,33.02 arc-90 13.72,32.89 13.72,25.91 arc-90 13.59,25.78 4.19,25.78 arc-90 4.06,25.91 4.06,32.89 arc-90
  cutout Bottom: 4.19,33.02 13.59,33.02 arc-90 13.72,32.89 13.72,25.91 arc-90 13.59,25.78 4.19,25.78 arc-90 4.06,25.91 4.06,32.89 arc-90
  cutout Top: 12.83,21.84 arc-90 13.84,22.86 arc-90 14.86,21.84 arc-90 13.84,20.83 arc-90
  cutout Top: 3.68,6.22 arc-90 4.7,7.24 arc-90 5.71,6.22 arc-90 4.7,5.21 arc-90
  pour Top: -1.27,-1.27 -1.27,34.29 19.05,34.29 19.05,-1.27
  pour Bottom: -1.27,-1.27 -1.27,34.29 19.05,34.29 19.05,-1.27
MISO/D22  (via drill 0.3)  (1 unrouted)
  Top 0.203: v13.77,10.92 14.33,10.92 14.58,10.67 14.58,10.34 15.54,9.37 15.54,7.32 CN4.10 | U2.21 8.41,17.58 8.41,17.65 8.76,18 v8.76,18.03
  Bottom 0.203: v8.76,18.03 9.58,18.03 11.4,19.86 11.4,20.68 11.71,20.98 12.17,20.98 12.47,20.68 12.47,19.63 13.03,19.07 13.03,18.47 13.66,17.83 13.66,11.02 v13.77,10.92
MOSI/D21  (via drill 0.3)  (1 unrouted)
  Top 0.203: U2.20 v8.89,17.5
  Bottom 0.203: CN4.11 15.24,3.81 12.83,6.22 11.35,6.22 8.48,9.09 8.48,12.78 7.87,13.39 7.87,13.97 9.28,15.38 10.23,15.38 10.52,15.66 10.52,16.06 10.22,16.36 10.06,16.36 8.91,17.5 v8.89,17.5
N$1  (via drill 0.3)
  Top 0.203: CN1.A6 9.14,24.89 8.66,24.41 v8.66,24 | CN1.B6 8.14,25.03 v6.99,23.88 6.8,23.69 F2.1
  Bottom 0.203: v8.66,24 8.53,23.88 v6.99,23.88
N$2
  Top 0.203: R2.1 R10.2 14.22,23.11 14.99,22.35 14.99,21.46 14.48,20.95 14.1,20.95 CUT2.2
N$3
  Top 0.61: U1.3 13.11,15.45 C2.1 13.11,16.33 D1.C
N$4
  Top 0.203: CN1.A7 8.64,25.02 7.87,24.26 F3.1 7.9,23.69 8.09,23.5 8.92,23.5 9.14,23.72 9.14,24.26 9.64,24.75 CN1.B7
N$5
  Top 0.203: F4.1 9.78,24.22 10.14,24.58 CN1.A5
N$6
  Top 0.305: CUT1.1 4.95,5.33 5.59,5.33 5.97,5.71 R1.2
N$7  (via drill 0.3)
  Top 0.203: v6.22,9.42 R3.1 | v7.44,11.05 8.43,11.05 11.51,14.12 11.51,16 11.53,16.03 11.68,16.03 LED3.1
  Bottom 0.203: v6.22,9.42 7.54,10.74 7.54,10.95 v7.44,11.05
N$8
  Top 0.203: CN1.B5 7.14,24.75 6.65,24.26 5.08,24.26 4.51,23.69 F5.1
N$9
  Top 0.203: R11.1 12.62,20.31 LED2.1
N$10  (via drill 0.3)
  Top 0.203: v3.53,10.39 R3.2 | v3.28,12.27 3.58,12.57 CUT3.2
  Bottom 0.203: v3.53,10.39 3.17,10.74 3.17,12.17 v3.28,12.27
N$11
  Top 0.203: R11.2 13.04,22.73 13.59,22.73 CUT2.1
N$12
  Top 0.203: U2.1 4.54,15.41 3.58,15.41 TP-PB3.TP
N$13
  Top 0.203: U2.3 4.87,14.61 4.54,14.61 4.5,14.56 3.86,14.56 TP-PA6.TP
N$14
  Top 0.203: U2.5 5.41,14.02 5.41,13.81 5.31,13.72 5.31,13.13 TP-PA0.TP
N$15
  Top 0.203: U2.9 7.55,13.33 7.55,12.98 TP-PA3.TP
N$16
  Top 0.203: U2.12 8.73,13.84 8.73,13.1 TP-PB2.TP
N$17
  Top 0.203: U2.22 8.33,18.07 8.33,18.34 8.64,18.64 TP-PB4.TP
N$18
  Top 0.203: U2.29 4.8,17.78 TP-PB5.TP
N$19
  Top 0.203: U2.30 4.82,17.2 4.01,17.2 TP-PB6.TP
N$38
  Top 0.203: R1.1 6.95,5.2 6.15,5.2 5.39,4.45 LED1.1
RESET/D7  (via drill 0.3)  (1 unrouted)
  Top 0.203: 10.54,10.95 10.54,11.61 SW1.C 9.63,11.78 8.47,10.62 6.38,10.62 5.21,11.78 SW1.D 4.98,12.39 4.98,13.87 5.08,13.97 5.08,14.25 U2.4 | 10.54,10.95 C5.1 | v14.68,18.34 v14.68,19.56 | v14.15,10.49 14.15,9.65 v14.17,9.63 | v11.68,8.05 11.68,8.13 v11,8.81 | v10.46,10.95 10.54,10.95
  Bottom 0.203: CN4.3 16.18,24.13 14.68,22.63 v14.68,19.56 | v14.68,18.34 14.88,18.14 14.88,11.76 14.2,11.07 14.2,10.54 v14.15,10.49 | v14.17,9.63 14.07,9.73 13.51,9.73 12.42,8.64 12.42,8.59 11.99,8.15 11.79,8.15 v11.68,8.05 | v11,8.81 10.82,8.81 10.34,9.3 10.34,10.82 v10.46,10.95
RX/D29/A6  (via drill 0.3)  (1 unrouted)
  Top 0.203: U2.28 4.83,18.31 v3.61,18.31
  Bottom 0.203: v3.61,18.31 3.71,18.41 3.71,24 3.61,24.11 3.61,24.54 2.77,25.38 2.31,25.38 1.91,25.78 1.91,26.04 CN3.11
SCK/D20  (via drill 0.3)  (1 unrouted)
  Top 0.203: CN4.9 14.91,10.49 14.91,10.97 v14.81,11.07 | U2.19 9.01,17.05 9.07,17.05 9.37,17.35 9.37,17.96 9.25,18.09 v9.25,18.47
  Bottom 0.203: v14.81,11.07 15.21,11.48 15.21,18.41 12.32,21.31 11.56,21.31 11.07,20.83 11.07,20.02 9.53,18.47 v9.25,18.47
SCL/D17  (via drill 0.3)  (1 unrouted)
  Top 0.203: v2.23,17.48 CN3.7 | v9.7,14.55 9.7,14.57 U2.15 | 12.06,4.95 R4.1 12.5,6.69 v12.5,6.71 | 12.06,4.95 CN2.4 | v11.61,3.96 12.06,4.42 12.06,4.95
  Bottom 0.203: v9.7,14.55 9.78,14.55 10.01,14.33 10.01,11.58 9.68,11.25 9.68,8.99 11.53,7.14 12.06,7.14 v12.5,6.71 | v2.23,17.48 2.23,17.35 3.5,16.08 3.5,13.13 4.29,12.34 4.29,9.98 9.17,5.11 10.54,5.11 11.61,4.04 v11.61,3.96
SDA/D16  (via drill 0.3)  (1 unrouted)
  Top 0.203: v3.96,7.09 3.96,6.81 3.81,6.66 v3.81,5.21 | CN2.3 R5.1 11.48,6.69 v11.48,6.71 | CN2.3 | v11.07,3.91 11.05,3.94 CN2.3 | v9.58,13.89 9.58,14.07 9.27,14.38 9.27,14.43 U2.14
  Bottom 0.203: v11.48,6.71 9.35,8.84 9.35,11.4 9.68,11.73 9.68,13.79 v9.58,13.89 | CN3.8 1.27,17.83 3.17,15.93 3.17,12.98 3.96,12.19 v3.96,7.09 | v3.81,5.21 4.01,5 8,5 8.23,4.78 10.39,4.78 11.07,4.09 v11.07,3.91
TX/D28/A5  (via drill 0.3)  (1 unrouted)
  Top 0.203: v4.47,18.75 4.57,18.64 5.01,18.64 5.18,18.47 5.24,18.47 U2.27
  Bottom 0.203: v4.47,18.75 4.37,18.85 4.37,21.92 5.11,22.66 5.11,23.09 3.94,24.26 3.94,24.69 2.92,25.7 2.46,25.7 2.23,25.93 2.23,28.25 CN3.12
VCC  (via drill 0.3)
  Top 0.305: v12.95,17.8 12.57,17.42 12.57,17.12 12.27,16.82 10.88,16.82 C4.1 9.44,16.35 U2.17 | v11.66,8.91 12.5,8.91 12.52,8.89 JP1.2
  Bottom 0.305: v12.95,17.8 13.01,17.8 13.28,17.53 13.28,10.54 v11.66,8.91

### Text on the board
tPlace: TX | 5V | RX | GND | RST | GND | CUT2 | 3V3 | 16 | A3 | L | 17 | A2 | 18 | A1 | CUT3 | 4 | A0 | 5V | 5 | 20 | 3V3 | RST | 23 | 22 | CUT1 | 24 | 21 | PWR | Mount / SM04B-SR / here. | 30 | 15
bPlace: TX | 5V | RX | GND | RST | GND | 3V3 | 16 | A3 | 17 | A2 | 18 | A1 | 4 | A0 | 5 | 20 | 23 | 22 | 24 | 21 | 30 | 15
Measures: Units in Inches
tDocu: Yuuki Umeta from UIAP